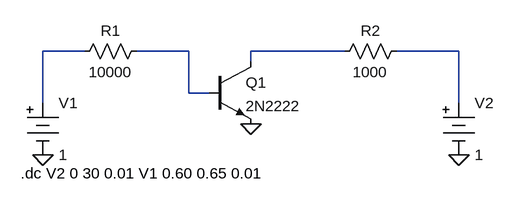
[diagram p0: schematic BJT.asc]
BJT.asc, the LTspice schematic file:
Version 4
SHEET 1 880 680
WIRE -48 112 -112 112
WIRE 112 112 32 112
WIRE 352 112 208 112
WIRE 528 112 432 112
WIRE 208 128 208 112
WIRE 112 176 112 112
WIRE 144 176 112 176
WIRE -112 192 -112 112
WIRE 528 192 528 112
FLAG 208 224 0
FLAG 528 272 0
FLAG -112 272 0
SYMBOL res 48 96 R90
WINDOW 0 0 56 VBottom 2
WINDOW 3 32 56 VTop 2
SYMATTR InstName R1
SYMATTR Value 10000
SYMBOL res 448 96 R90
WINDOW 0 0 56 VBottom 2
WINDOW 3 32 56 VTop 2
SYMATTR InstName R2
SYMATTR Value 1000
SYMBOL npn 144 128 R0
SYMATTR InstName Q1
SYMATTR Value 2N2222
SYMBOL Misc\\battery -112 176 R0
SYMATTR InstName V1
SYMATTR Value 1
SYMBOL Misc\\battery 528 176 R0
SYMATTR InstName V2
SYMATTR Value 1
TEXT -146 300 Left 2 !.dc V2 0 30 0.01 V1 0.60 0.65 0.01

The netlist it stands for:
* BJT.asc
R1 N002 N001 10000
R2 N004 N003 1000
Q1 N003 N002 0 0 2N2222
V1 N001 0 1
V2 N004 0 1
.model NPN NPN
.model PNP PNP
.lib standard.bjt
.dc V2 0 30 0.01 V1 0.60 0.65 0.01
.backanno
.end